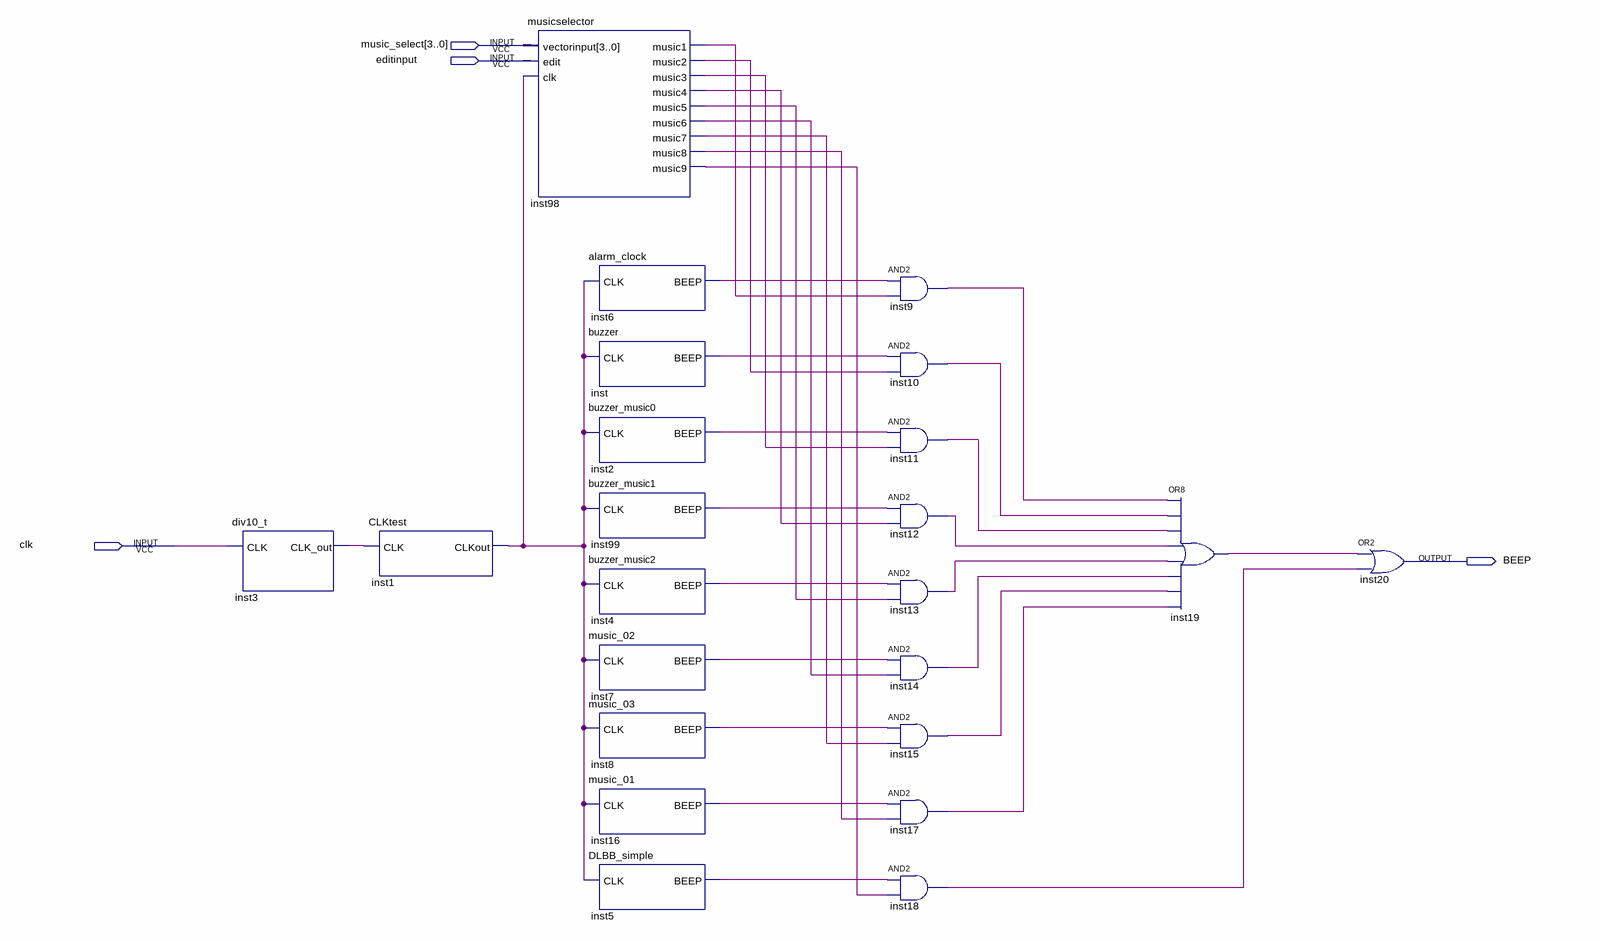
[diagram p0: schematic sheet]
// Quartus schematic Test.bdf as structural Verilog: 23 symbols, 4 pins
module Test (
  input  [3:0] music_select,
  input  editinput,
  input  clk,
  output BEEP
);

  wire inst1_clkout, inst2_beep, inst3_clk_out, inst4_beep, inst5_beep, inst6_beep, inst7_beep, inst8_beep,
       inst9_out, inst10_out, inst11_out, inst12_out, inst13_out, inst14_out, inst15_out, inst16_beep,
       inst17_out, inst18_out, inst19_out, inst98_music1, inst98_music2, inst98_music3, inst98_music4,
       inst98_music5, inst98_music6, inst98_music7, inst98_music8, inst98_music9, inst99_beep, inst_beep;

  div10_t inst3 (.CLK(clk), .CLK_out(inst3_clk_out));
  CLKtest inst1 (.CLK(inst3_clk_out), .CLKout(inst1_clkout));
  musicselector inst98 (
    .vectorinput(music_select), .edit(editinput), .clk(inst1_clkout), .music1(inst98_music1),
    .music2(inst98_music2), .music3(inst98_music3), .music4(inst98_music4), .music5(inst98_music5),
    .music6(inst98_music6), .music7(inst98_music7), .music8(inst98_music8), .music9(inst98_music9));
  alarm_clock inst6 (.CLK(inst1_clkout), .BEEP(inst6_beep));
  buzzer inst (.CLK(inst1_clkout), .BEEP(inst_beep));
  buzzer_music0 inst2 (.CLK(inst1_clkout), .BEEP(inst2_beep));
  buzzer_music1 inst99 (.CLK(inst1_clkout), .BEEP(inst99_beep));
  buzzer_music2 inst4 (.CLK(inst1_clkout), .BEEP(inst4_beep));
  music_02 inst7 (.CLK(inst1_clkout), .BEEP(inst7_beep));
  music_03 inst8 (.CLK(inst1_clkout), .BEEP(inst8_beep));
  music_01 inst16 (.CLK(inst1_clkout), .BEEP(inst16_beep));
  DLBB_simple inst5 (.CLK(inst1_clkout), .BEEP(inst5_beep));
  and inst9 (inst9_out, inst6_beep, inst98_music1);
  and inst10 (inst10_out, inst_beep, inst98_music2);
  and inst11 (inst11_out, inst2_beep, inst98_music3);
  and inst12 (inst12_out, inst99_beep, inst98_music4);
  and inst13 (inst13_out, inst4_beep, inst98_music5);
  and inst14 (inst14_out, inst7_beep, inst98_music6);
  and inst15 (inst15_out, inst8_beep, inst98_music7);
  and inst17 (inst17_out, inst16_beep, inst98_music8);
  and inst18 (inst18_out, inst5_beep, inst98_music9);
  or inst19 (inst19_out, inst9_out, inst10_out, inst11_out, inst12_out, inst13_out, inst14_out, inst15_out, inst17_out);
  or inst20 (BEEP, inst19_out, inst18_out);
endmodule
